# Altium schematic sheet t1-power.SchDoc
size A3
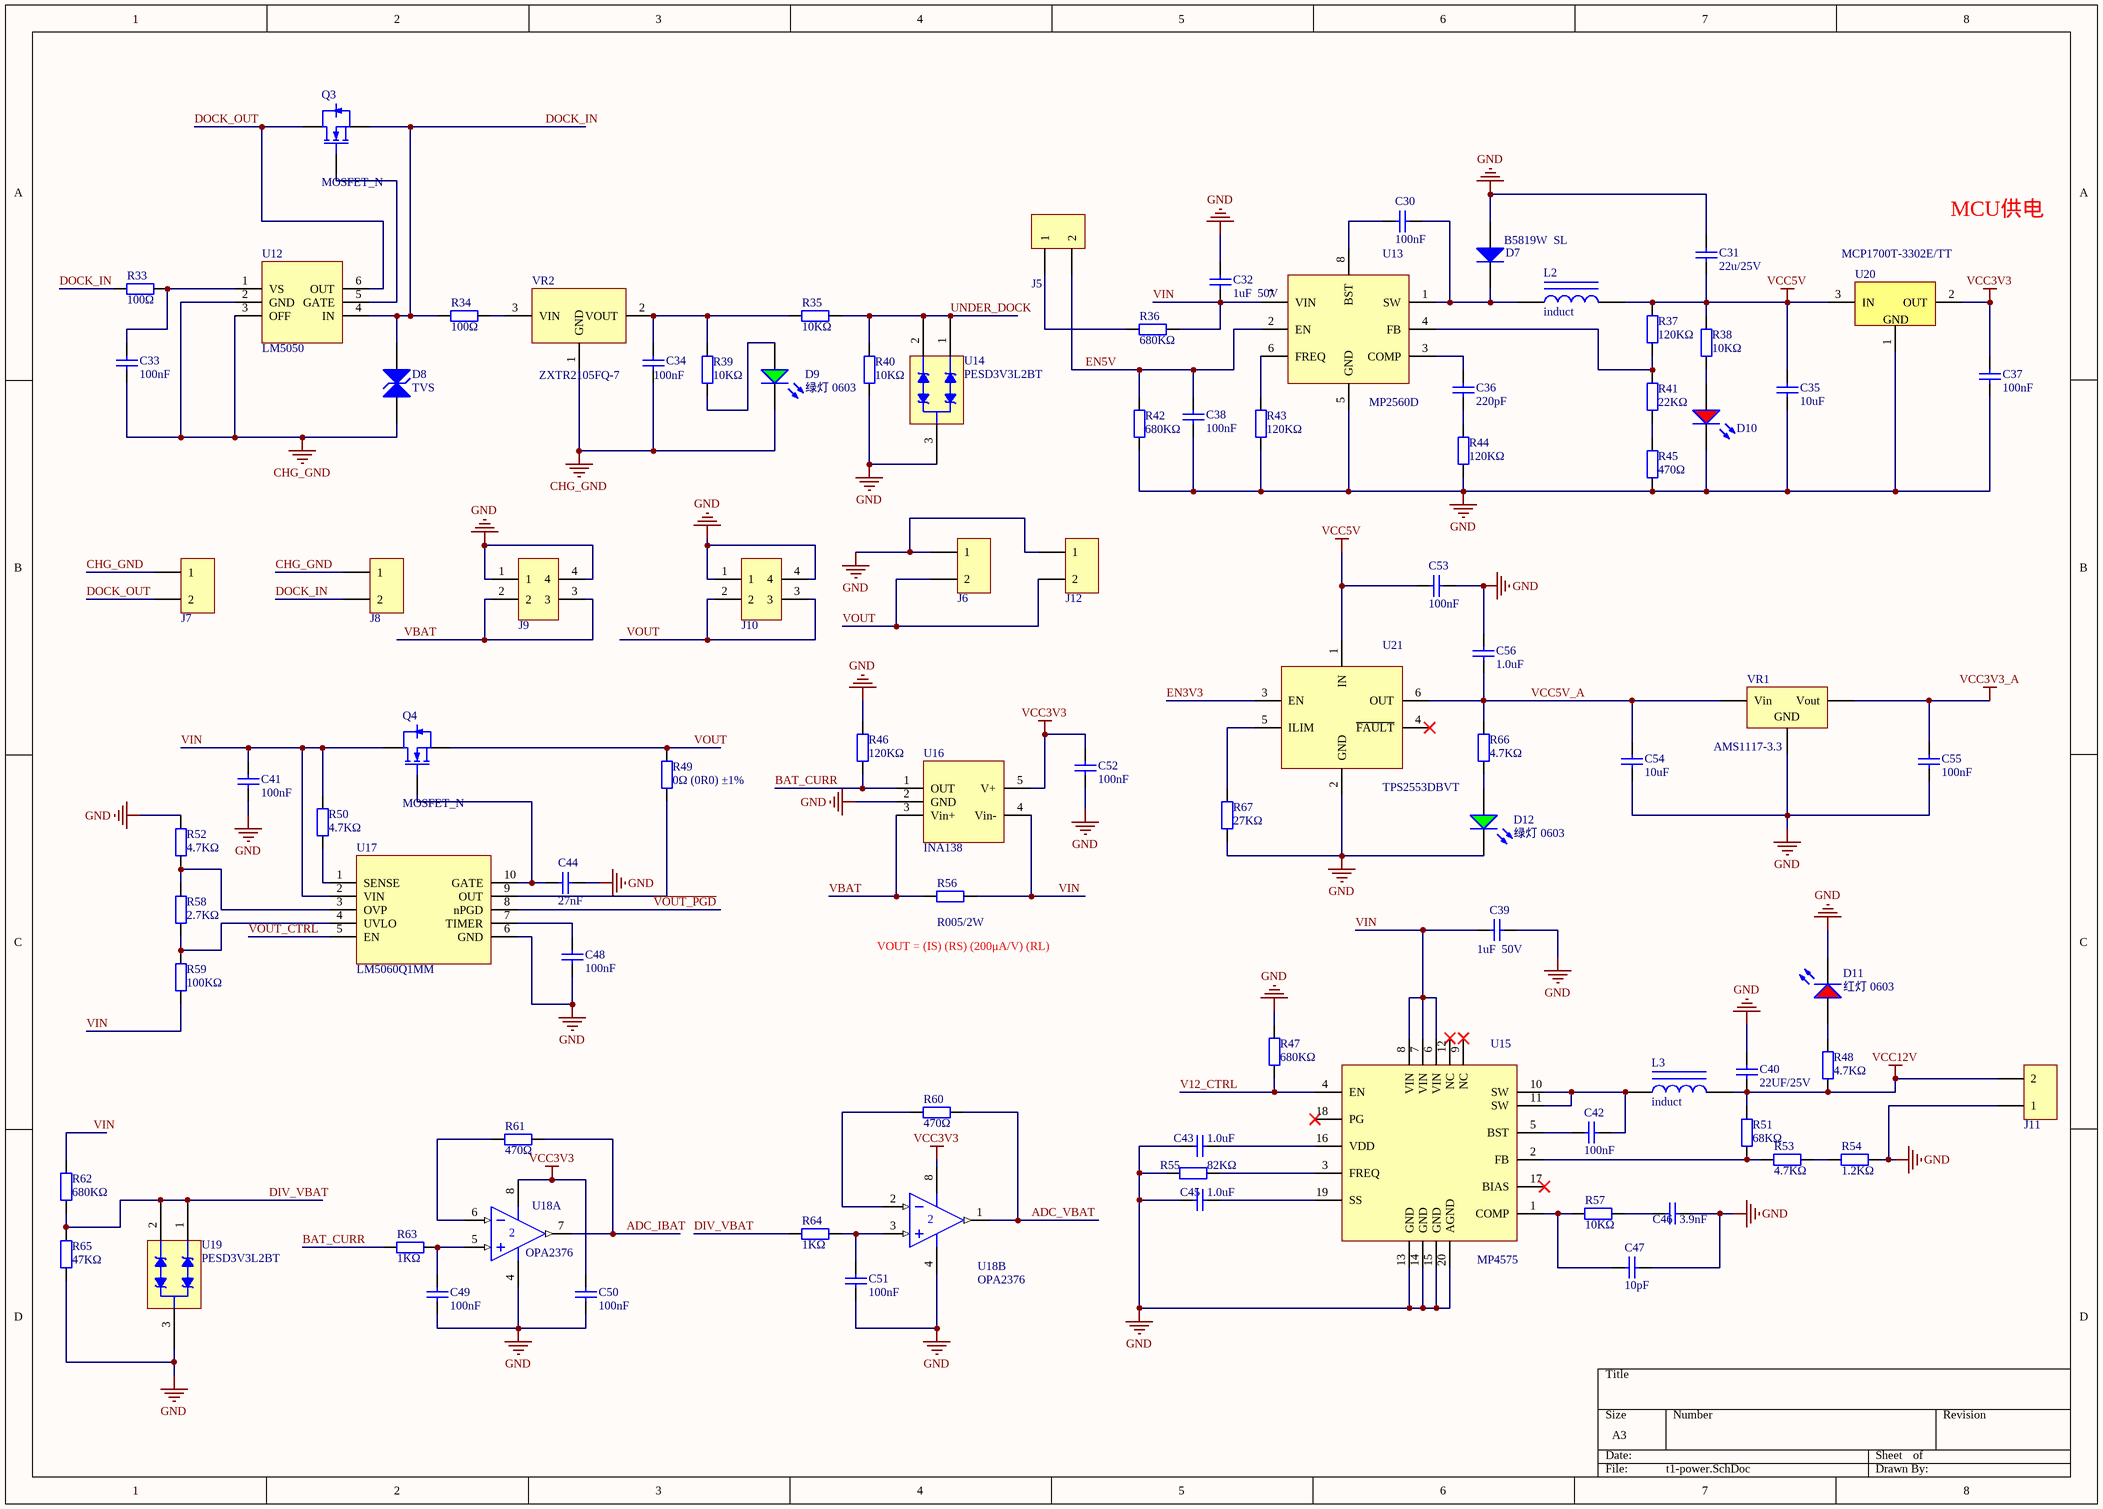
[diagram p0: t1-power.SchDoc]

## Parts
C30  100nF  [0402_C]
C31  22u/25V  [1206_C]
C32  1uF  50V  [0603_C]
C33  100nF  [0402_C]
C34  100nF  [0402_C]
C35  10uF  [0603_C]
C36  220pF  [0402_C]
C37  100nF  [0402_C]
C38  100nF  [0402_C]
C39  1uF  50V  [1206_C]
C40  22UF/25V  [1206_C]
C41  100nF  [0402_C]
C42  100nF  [0402_C]
C43  1.0uF  [0402_C]
C44  27nF  [0402_C]
C45  1.0uF  [0402_C]
C46  3.9nF  [0402_C]
C47  10pF  [0402_C]
C48  100nF  [0402_C]
C49  100nF  [0402_C]
C50  100nF  [0402_C]
C51  100nF  [0402_C]
C52  100nF  [0402_C]
C53  100nF  [0402_C]
C54  10uF  [0603_C]
C55  100nF  [0402_C]
C56  1.0uF  [0402_C]
D7  B5819W  SL  [SOD-123]
D8  TVS  [DO-214AC]
D9  绿灯 0603  [0603_LED_S1]
D10  红灯 0603  [0603_LED_S1]  (value not drawn)
D11  红灯 0603  [0603_LED_S1]
D12  绿灯 0603  [0603_LED_S1]
J5  MOTOR  [KF2510-2A针座-2.54mm]  (value not drawn)
J6  MOTOR  [5557_a]  (value not drawn)
J7  MOTOR  [MX_3.0_2X1P]  (value not drawn)
J8  MOTOR  [MX_3.0_2X1P]  (value not drawn)
J9  HEADER_2*2P  [5557_2*2PA]  (value not drawn)
J10  HEADER_2*2P  [5557_2*2PA]  (value not drawn)
J11  MOTOR  [MX_3.0_2X1P]  (value not drawn)
J12  MOTOR  [5557_a]  (value not drawn)
L2  induct  [SMD,5.0x5.0x4.0mm]
L3  induct  [SMD,5.0x5.0x4.0mm]
Q3  MOSFET_N  [TO-252-2]
Q4  MOSFET_N  [T0-263-2]
R33  100Ω  [0402_R]
R34  100Ω  [0402_R]
R35  10KΩ  [0402_R]
R36  680KΩ  [0402_R]
R37  120KΩ  [0402_R]
R38  10KΩ  [0402_R]
R39  10KΩ  [0402_R]
R40  10KΩ  [0402_R]
R41  22KΩ  [0402_R]
R42  680KΩ  [0402_R]
R43  120KΩ  [0402_R]
R44  120KΩ  [0402_R]
R45  470Ω  [0402_R]
R46  120KΩ  [0402_R]
R47  680KΩ  [0402_R]
R48  4.7KΩ  [0402_R]
R49  0Ω (0R0) ±1%  [0402_R]
R50  4.7KΩ  [0402_R]
R51  68KΩ  [0402_R]
R52  4.7KΩ  [0402_R]
R53  4.7KΩ  [0402_R]
R54  1.2KΩ  [0402_R]
R55  82KΩ  [0402_R]
R56  R005/2W  [2512]
R57  10KΩ  [0402_R]
R58  2.7KΩ  [0402_R]
R59  100KΩ  [0402_R]
R60  470Ω  [0402_R]
R61  470Ω  [0402_R]
R62  680KΩ  [0402_R]
R63  1KΩ  [0402_R]
R64  1KΩ  [0402_R]
R65  47KΩ  [0402_R]
R66  4.7KΩ  [0402_R]
R67  27KΩ  [0402_R]
U12  LM5050  [TSOT-23-6]
U13  MP2560D  [SOP-8_150mil]
U14  PESD3V3L2BT  [SOT-23(SOT-23-3)]
U15  MP4575  [TSSOP-20]
U16  INA138  [SOT-23-5]
U17  LM5060Q1MM  [VSSOP-10]
U18  OPA2376  [SOP-8_150mil]  (parts A,B of 2)
U19  PESD3V3L2BT  [SOT-23(SOT-23-3)]
U20  MCP1700T-3302E/TT  [SOT-23-3]
U21  TPS2553DBVT  [SOT-23-6]
VR1  AMS1117-3.3  [SOT-223]
VR2  ZXTR2105FQ-7  [SOT-23-3]

## Nets
CHG_GND: C33.1 C34.1 D8.1(A) D9.K J7.1 J8.1 U12.2(GND) U12.3(OFF) VR2.1(GND)
GND: C31.2 C32.2 C35.1 C37.1 C38.1 C39.2 C40.2 C41.1 C43.2 C44.2 C45.2 C46.2 C47.2 C48.2 C49.1 C50.1 C51.2 C52.2 C53.2 C54.1 C55.1 C56.2 D7.1(A) D10.K D11.K D12.K J6.1 J9.1 J9.4 J10.1 J10.4 J11.1 J12.1 R40.2 R42.1 R43.1 R44.1 R45.1 R46.2 R47.2 R52.1 R54.2 R55.1 R65.1 R67.1 U13.5(GND) U14.3 U15.13(GND) U15.14(GND) U15.15(GND) U15.20(AGND) U16.2(GND) U17.6(GND) U18.4(V-) U19.3 U20.1 U21.2(GND) VR1.1(GND)
VCC3V3: C37.2 C50.2 C52.1 U16.5(V+) U18.8(V+) U20.2(OUT)
VCC3V3_A: C55.2 VR1.2(Vout)
VCC5V: C31.1 C35.2 C53.1 L2.2 R37.2 R38.2 U20.3(IN) U21.1(IN)
VCC12V: C40.1 J11.2 L3.2 R48.1 R51.2
ADC_IBAT: R61.2 U18.7(OUT)
ADC_VBAT: R60.2 U18.1(OUT)
BAT_CURR: R46.1 R63.1 U16.1(OUT)
DIV_VBAT: R62.1 R64.1 R65.2 U19.1 U19.2
DOCK_IN: D8.2(K) J8.2 Q3.3(S) R33.1 R34.1 U12.4(IN)
DOCK_OUT: J7.2 Q3.2(D) U12.6(OUT)
EN3V3: U21.3(EN)
EN5V: C38.2 J5.2 R42.2 U13.2(EN)
UNDER_DOCK: R35.1 R40.1 U14.1 U14.2
V12_CTRL: R47.1 U15.4(EN)
~{VOUT_PGD}: U17.8(nPGD)
VBAT: J9.2 J9.3 R56.1 U16.3(Vin+)
VCC5V_A: C54.2 C56.1 R66.2 U21.6(OUT) VR1.3(Vin)
VIN: C32.1 C39.1 C41.2 Q4.2(D) R36.2 R50.2 R56.2 R59.2 R62.2 U13.7(VIN) U15.6(VIN) U15.7(VIN) U15.8(VIN) U16.4(Vin-) U17.2(VIN)
VOUT: J6.2 J10.2 J10.3 J12.2 Q4.3(S) R49.2
VOUT_CTRL: U17.5(EN)
NetC30_1: C30.1 D7.2(K) L2.1 U13.1(SW)
NetC30_2: C30.2 U13.8(BST)
NetC33_2: C33.2 R33.2 U12.1(VS)
NetC34_2: C34.2 R35.2 R39.2 VR2.2(VOUT)
NetC36_1: C36.1 R44.2
NetC36_2: C36.2 U13.3(COMP)
NetC42_1: C42.1 L3.1 U15.10(SW) U15.11(SW)
NetC42_2: C42.2 U15.5(BST)
NetC43_1: C43.1 U15.16(VDD)
NetC44_1: C44.1 Q4.1(G) U17.10(GATE)
NetC45_1: C45.1 U15.19(SS)
NetC46_1: C46.1 R57.2
NetC47_1: C47.1 R57.1 U15.1(COMP)
NetC48_1: C48.1 U17.7(TIMER)
NetC49_2: C49.2 R63.2 U18.5(IN+)
NetC51_1: C51.1 R64.2 U18.3(IN+)
NetD9_A: D9.A R39.1
NetD10_A: D10.A R38.1
NetD11_A: D11.A R48.2
NetD12_A: D12.A R66.1
NetJ5_1: J5.1 R36.1
NetQ3_1: Q3.1(G) U12.5(GATE)
NetR34_2: R34.2 VR2.3(VIN)
NetR37_1: R37.1 R41.2 U13.4(FB)
NetR41_1: R41.1 R45.2
NetR43_2: R43.2 U13.6(FREQ)
NetR49_1: R49.1 U17.9(OUT)
NetR50_1: R50.1 U17.1(SENSE)
NetR51_1: R51.1 R53.1 U15.2(FB)
NetR52_2: R52.2 R58.1 U17.3(OVP)
NetR53_2: R53.2 R54.1
NetR55_2: R55.2 U15.3(FREQ)
NetR58_2: R58.2 R59.1 U17.4(UVLO)
NetR60_1: R60.1 U18.2(IN-)
NetR61_1: R61.1 U18.6(IN-)
NetR67_2: R67.2 U21.5(ILIM)

Not connected (* = marked no-connect by the designer): U15 9(NC)* 12(NC)* 17(BIAS)* 18(PG)*; U21 4(~{FAULT})*

## Notes on the sheet
- MCU供电
- (near R56) VOUT = (IS) (RS) (200μA/V) (RL)
- (in symbol MCP1700T-3302E/TT LDO 3.3V) GND /

## Library data of the parts
C30 C33 C34 C37 C38 C41 C42 C48-C53 C55 = 0402 100nF (104) 10% 16V: 贴片电容; ComponentLink1Description: 供应商链接; ComponentLink1URL: http://www.szlcsc.com/product/details_1877.html; Package: 0402; Supplier: LC; SuppliersPartNumber: C1525
C31 = 1206 220pF (221) 10% 50V: 贴片电容; ComponentLink1Description: 供应商链接; ComponentLink1URL: http://www.szlcsc.com/product/details_2206.html; Package: 1206; Supplier: LC; SuppliersPartNumber: C1854
C32 = 0603 1uF (105) 10% 50V: 贴片电容; ComponentLink1Description: 供应商链接; ComponentLink1URL: http://www.szlcsc.com/product/details_16531.html; Package: 0603; Supplier: LC; SuppliersPartNumber: C15849
C35 C54 = 0603 10uF (106) 10% 10V: 贴片电容; ComponentLink1Description: 供应商链接; ComponentLink1URL: http://www.szlcsc.com/product/details_20411.html; Package: 0603; Supplier: LC; SuppliersPartNumber: C19702
C36 = 0402 220pF (221) 10% 50V: 贴片电容; ComponentLink1Description: 供应商链接; ComponentLink1URL: http://www.szlcsc.com/product/details_1882.html; Package: 0402; Supplier: LC; SuppliersPartNumber: C1530
C39 = 1206 1uF (105) 10% 50V: 贴片电容; ComponentLink1Description: 供应商链接; ComponentLink1URL: http://www.szlcsc.com/product/details_2200.html; Package: 1206; Supplier: LC; SuppliersPartNumber: C1848
C40 = 1206 10uF (106) 10% 50V: 贴片电容; ComponentLink1Description: 供应商链接; ComponentLink1URL: http://www.szlcsc.com/product/details_14236.html; Package: 1206; Supplier: LC; SuppliersPartNumber: C13585
C43-C45 C56 = 0402 1.0uF (105) 10% 25V: 贴片电容; ComponentLink1Description: 供应商链接; ComponentLink1URL: http://www.szlcsc.com/product/details_53938.html; Package: 0402; Supplier: LC; SuppliersPartNumber: C52923
C46 C47 = 0402 10pF (100) 5% 50V: 贴片电容; ComponentLink1Description: 供应商链接; ComponentLink1URL: http://www.szlcsc.com/product/details_33914.html; Package: 0402; Supplier: LC; SuppliersPartNumber: C32949
D7 = SOD-123 B5819W  SL: 肖特基二极管; ComponentLink1Description: 供应商链接; ComponentLink1URL: http://www.szlcsc.com/product/details_9093.html; Package: SOD-123; Supplier: LC; SuppliersPartNumber: C8598
D9 D12 = 0603 绿灯: 发光二极管; ComponentLink1Description: 供应商链接; ComponentLink1URL: http://www.szlcsc.com/product/details_73152.html; Package: 0603; Supplier: LC; SuppliersPartNumber: C72043
D10 D11 = 0603 红灯: 发光二极管; ComponentLink1Description: 供应商链接; ComponentLink1URL: http://www.szlcsc.com/product/details_2659.html; Package: 0603; Supplier: LC; SuppliersPartNumber: C2286
J5-J8 J11 J12 = header2
R33 R34 = 0402 100Ω (1000) 1%: 贴片电阻; ComponentLink1Description: 供应商链接; ComponentLink1URL: http://www.szlcsc.com/product/details_25819.html; Package: 0402; Supplier: LC; SuppliersPartNumber: C25076
R35 R37-R40 R57 = 0402 10KΩ (1002) 1%: 贴片电阻; ComponentLink1Description: 供应商链接; ComponentLink1URL: http://www.szlcsc.com/product/details_26487.html; Package: 0402; Supplier: LC; SuppliersPartNumber: C25744
R36 R42 R47 R55 R62 = 0402 680Ω (6800) 1%: 贴片电阻; ComponentLink1Description: 供应商链接; ComponentLink1URL: http://www.szlcsc.com/product/details_25873.html; Package: 0402; Supplier: LC; SuppliersPartNumber: C25130
R41 = 0402 22KΩ (2202) 1%: 贴片电阻; ComponentLink1Description: 供应商链接; ComponentLink1URL: http://www.szlcsc.com/product/details_26511.html; Package: 0402; Supplier: LC; SuppliersPartNumber: C25768
R43 R44 R46 = 0402 120KΩ (1203) 1%: 贴片电阻; ComponentLink1Description: 供应商链接; ComponentLink1URL: http://www.szlcsc.com/product/details_26493.html; Package: 0402; Supplier: LC; SuppliersPartNumber: C25750
R45 R60 R61 = 0402 470Ω (4700) 1%: 贴片电阻; ComponentLink1Description: 供应商链接; ComponentLink1URL: http://www.szlcsc.com/product/details_25860.html; Package: 0402; Supplier: LC; SuppliersPartNumber: C25117
R48 R65 = 0402 47KΩ (4702) 1%: 贴片电阻; ComponentLink1Description: 供应商链接; ComponentLink1URL: http://www.szlcsc.com/product/details_26535.html; Package: 0402; Supplier: LC; SuppliersPartNumber: C25792
R49 = 0402 0Ω (0R0) 1%: 贴片电阻; ComponentLink1Description: 供应商链接; ComponentLink1URL: http://www.szlcsc.com/product/details_17853.html; Package: 0402; Supplier: LC; SuppliersPartNumber: C17168
R50 R52 R53 R58 R66 = 0402 4.7KΩ (4701) 1%: 贴片电阻; ComponentLink1Description: 供应商链接; ComponentLink1URL: http://www.szlcsc.com/product/details_26643.html; Package: 0402; Supplier: LC; SuppliersPartNumber: C25900
R51 = 0402 68KΩ (6802) 1%: 贴片电阻; ComponentLink1Description: 供应商链接; ComponentLink1URL: http://www.szlcsc.com/product/details_37849.html; Package: 0402; Supplier: LC; SuppliersPartNumber: C36871
R54 = 0402 1.2KΩ (1201) 1%: 贴片电阻; ComponentLink1Description: 供应商链接; ComponentLink1URL: http://www.szlcsc.com/product/details_26605.html; Package: 0402; Supplier: LC; SuppliersPartNumber: C25862
R56 = RES
R59 = 0402 100KΩ (1003) 1%: 贴片电阻; ComponentLink1Description: 供应商链接; ComponentLink1URL: http://www.szlcsc.com/product/details_26484.html; Package: 0402; Supplier: LC; SuppliersPartNumber: C25741
R63 R64 = 0402 1KΩ (1001) 1%: 贴片电阻; ComponentLink1Description: 供应商链接; ComponentLink1URL: http://www.szlcsc.com/product/details_12256.html; Package: 0402; Supplier: LC; SuppliersPartNumber: C11702
R67 = 0402 27KΩ (2702) 1%: 贴片电阻; ComponentLink1Description: 供应商链接; ComponentLink1URL: http://www.szlcsc.com/product/details_26514.html; Package: 0402; Supplier: LC; SuppliersPartNumber: C25771
U13 = MP2560D: MP2560D_SOIC-8_EP_150mil
U14 U19 = PSM712-LF-T7_[C32677]: TVS; ComponentLink1Description: 供应商链接; ComponentLink1URL: http://www.szlcsc.com/product/details_33642.html; Package: SOT-23(SOT-23-3); Supplier: LC; SuppliersPartNumber: C32677
U15 = MP4575: MP4575_TSSOP-20
U16 = INA138: SOT-23-5
U18 = OPA2376: 精密运放
U20 = MCP1700T-3302E/TT LDO 3.3V: https://item.szlcsc.com/40034.html LDO 3.3V
U21 = TPS2553DBVT: SOT-23-6
VR1 = SOT-223 AMS1117-3.3: 低压差线性稳压(LDO); ComponentLink1Description: 供应商链接; ComponentLink1URL: http://www.szlcsc.com/product/details_6652.html; Package: SOT-223; Supplier: LC; SuppliersPartNumber: C6186
VR2 = ZXTR2105FQ-7: 线性稳压芯片 60V 89ma